# Altium schematic sheet FT2232H.SchDoc
size A
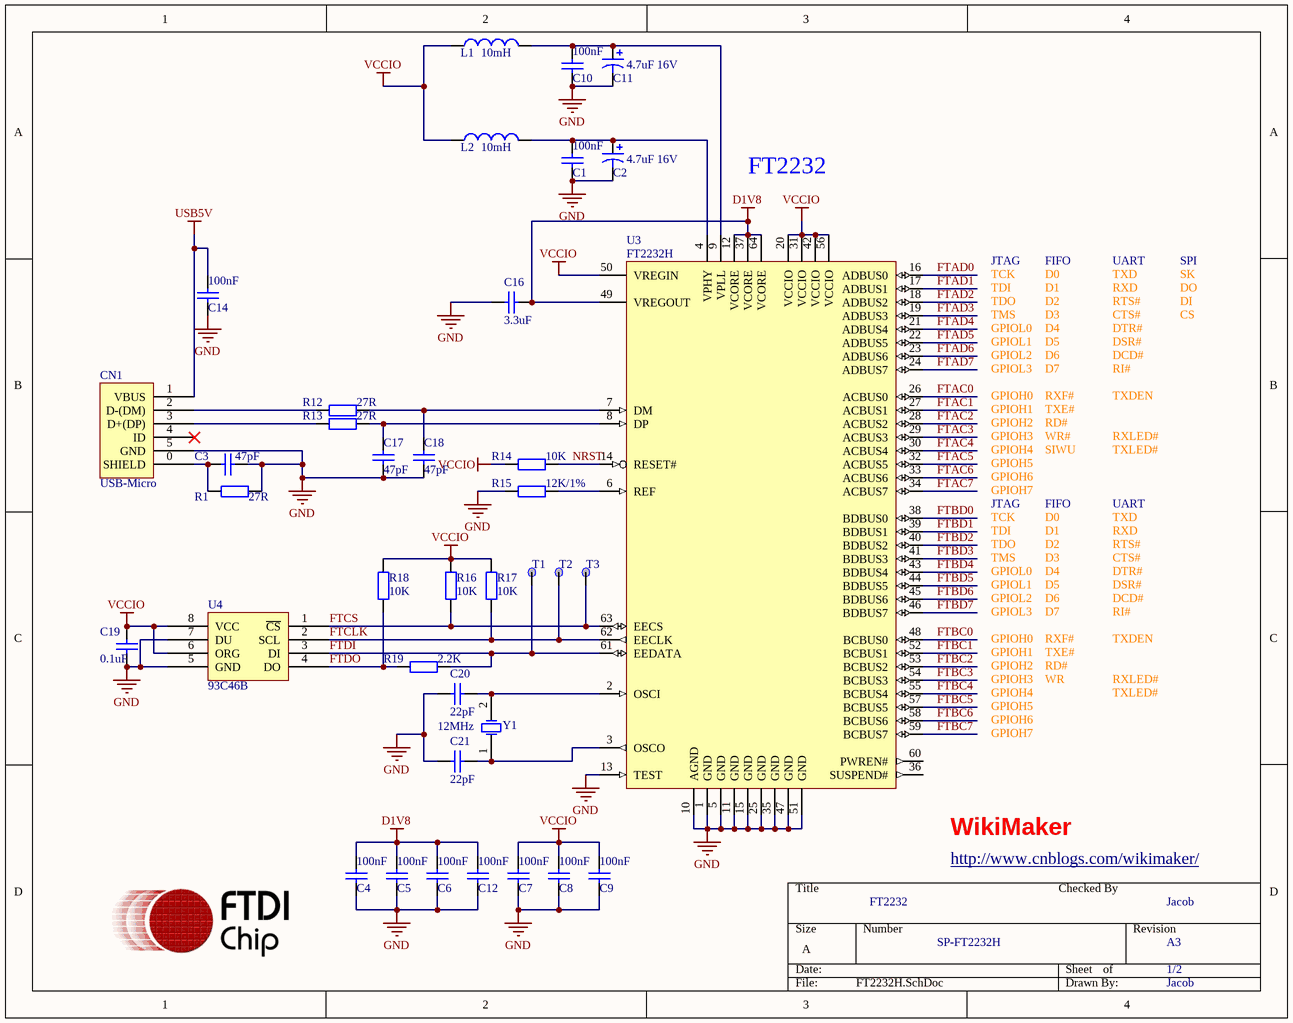
[diagram p0: FT2232H.SchDoc]

## Parts
C1  100nF  [0603M]
C2  4.7uF 16V  [0805M]
C3  47pF  [0603M]
C4  100nF  [0603M]
C5  100nF  [0603M]
C6  100nF  [0603M]
C7  100nF  [0603M]
C8  100nF  [0603M]
C9  100nF  [0603M]
C10  100nF  [0603M]
C11  4.7uF 16V  [0805M]
C12  100nF  [0603M]
C14  100nF  [0603M]
C16  3.3uF  [0805M]
C17  47pF  [0603M]
C18  47pF  [0603M]
C19  0.1uF  [0603M]
C20  22pF  [0603M]
C21  22pF  [0603M]
CN1  USB-Micro  [USB-MICRO-Lite]
L1  value 10mH  [0805M]  (hidden comment: Inductor)
L2  value 10mH  [0805M]  (hidden comment: Inductor)
R1  27R  [0603M]
R12  27R  [0603M]
R13  27R  [0603M]
R14  10K  [0603M]
R15  12K/1%  [0603M]
R16  10K  [0603M]
R17  10K  [0603M]
R18  10K  [0603M]
R19  2.2K  [0603M]
T1  TP  [TP-HOLE]  (value not drawn)
T2  TP  [TP-HOLE]  (value not drawn)
T3  TP  [TP-HOLE]  (value not drawn)
U3  FT2232H  [LQFP-64_N]
U4  93C46B  [SO8_L]
Y1  12MHz  [XTAL_socket]

## Nets
D1V8: C4.2 C5.2 C6.2 C12.2 C16.1 U3.12(VCORE) U3.37(VCORE) U3.49(VREGOUT) U3.64(VCORE)
GND: C1.1 C2.2 C3.2 C4.1 C5.1 C6.1 C7.1 C8.1 C9.1 C10.1 C11.2 C12.1 C14.1 C16.2 C17.1 C18.1 C19.2 C20.1 C21.1 CN1.5(GND) R1.1 R15.2 U3.1(GND) U3.5(GND) U3.10(AGND) U3.11(GND) U3.13(TEST) U3.15(GND) U3.25(GND) U3.35(GND) U3.47(GND) U3.51(GND) U4.5(GND) U4.7(DU)
USB5V: C14.2 CN1.1(VBUS)
VCCIO: C7.2 C8.2 C9.2 C19.1 L1.1 L2.1 R14.2 R16.1 R17.1 R18.1 U3.20(VCCIO) U3.31(VCCIO) U3.42(VCCIO) U3.50(VREGIN) U3.56(VCCIO) U4.6(ORG) U4.8(VCC)
FTAC0: U3.26(ACBUS0)
FTAC1: U3.27(ACBUS1)
FTAC2: U3.28(ACBUS2)
FTAC3: U3.29(ACBUS3)
FTAC4: U3.30(ACBUS4)
FTAC5: U3.32(ACBUS5)
FTAC6: U3.33(ACBUS6)
FTAC7: U3.34(ACBUS7)
FTAD0: U3.16(ADBUS0)
FTAD1: U3.17(ADBUS1)
FTAD2: U3.18(ADBUS2)
FTAD3: U3.19(ADBUS3)
FTAD4: U3.21(ADBUS4)
FTAD5: U3.22(ADBUS5)
FTAD6: U3.23(ADBUS6)
FTAD7: U3.24(ADBUS7)
FTBC0: U3.48(BCBUS0)
FTBC1: U3.52(BCBUS1)
FTBC2: U3.53(BCBUS2)
FTBC3: U3.54(BCBUS3)
FTBC4: U3.55(BCBUS4)
FTBC5: U3.57(BCBUS5)
FTBC6: U3.58(BCBUS6)
FTBC7: U3.59(BCBUS7)
FTBD0: U3.38(BDBUS0)
FTBD1: U3.39(BDBUS1)
FTBD2: U3.40(BDBUS2)
FTBD3: U3.41(BDBUS3)
FTBD4: U3.43(BDBUS4)
FTBD5: U3.44(BDBUS5)
FTBD6: U3.45(BDBUS6)
FTBD7: U3.46(BDBUS7)
FTCLK: R17.2 T2.1 U3.62(EECLK) U4.2(SCL)
FTCS: R16.2 T3.1 U3.63(EECS) U4.1(~{CS})
FTDI: R19.1 T1.1 U3.61(EEDATA) U4.3(DI)
FTDO: R18.2 R19.2 U4.4(DO)
NRST: R14.1 U3.14(RESET#)
NetC1_2: C1.2 C2.1 L2.2 U3.4(VPHY)
NetC3_1: C3.1 CN1.0(SHIELD) R1.2
NetC10_2: C10.2 C11.1 L1.2 U3.9(VPLL)
NetC17_2: C17.2 R13.1 U3.8(DP)
NetC18_2: C18.2 R12.1 U3.7(DM)
NetC20_2: C20.2 U3.2(OSCI) Y1.2(OSC2)
NetC21_2: C21.2 U3.3(OSCO) Y1.1(OSC1)
NetCN1_2: CN1.2(D-(DM)) R12.2
NetCN1_3: CN1.3(D+(DP)) R13.2
NetR15_1: R15.1 U3.6(REF)

Not connected (* = marked no-connect by the designer): CN1 4(ID)*; U3 36(SUSPEND#) 60(PWREN#)

## Notes on the sheet
- FT2232
- JTAG
- TDI
- TCK
- D0
- D1
- FIFO
- UART
- TXD
- RXD
- SPI
- SK
- DO
- TMS
- TDO
- GPIOL0
- GPIOL1
- GPIOL2
- GPIOL3
- D2
- D3
- D4
- D5
- D6
- D7
- RTS#
- CTS#
- DTR#
- DSR#
- DCD#
- RI#
- DI
- CS
- GPIOH0
- GPIOH1
- GPIOH2
- RXF#
- TXE#
- RD#
- TXDEN
- GPIOH3
- GPIOH4
- GPIOH5
- GPIOH6
- GPIOH7
- WR#
- SIWU
- RXLED#
- TXLED#
- WR
- WikiMaker
- http://www.cnblogs.com/wikimaker/
- Checked By
- Jacob
- SP-FT2232H
- A3
- 1/2

## Library data of the parts
C1 C3-C10 C12 C14 C16-C21 = Cap: Capacitor; Published: 8-Jun-2000; LatestRevisionDate: 17-Jul-2002; LatestRevisionNote: Re-released for DXP Platform.; PackageReference: RAD-0.3; Publisher: Altium Limited
  C1 C4-C10 C12 C14: PackageDescription: Radial Cap, Thru-Hole; 2 Leads; 0.3 in Pin Spacing; Value: 100nF
  C3 C17 C18: Value: 47pF
  C16: Value: 3.3uF
  C19: Value: 0.1uF
  C20 C21: Value: 22pF
C2 C11 = Cap Pol1: Polarized Capacitor (Radial); Published: 8-Jun-2000; LatestRevisionDate: 17-Jul-2002; LatestRevisionNote: Re-released for DXP Platform.; PackageReference: RB7.6-15; Publisher: Altium Limited; PackageDescription: Polarized Capacitor (Radial); 2 Leads
L1 L2 = Inductor: Code_IEC: 1005; Published: 8-Jun-2000; LatestRevisionDate: 29-May-2009; LatestRevisionNote: IPC-7351 Footprint Added.; PackageReference: 0402-A; Publisher: Altium Limited; PackageDescription: Chip Inductor; Code_JEITA: 0402
R1 R12-R19 = Res2: Resistor; Published: 8-Jun-2000; LatestRevisionDate: 17-Jul-2002; LatestRevisionNote: Re-released for DXP Platform.; PackageReference: AXIAL-0.4; Publisher: Altium Limited
  R1 R12 R13: Value: 27R
  R14 R16-R18: Value: 10K
  R15: Value: 12K/1%
  R19: Value: 2.2K
T1-T3 = TP: Test Point
U3 = FT2232HL-Reel: Dual High Speed USB To Multipurpose UART/FIFO IC, LQFP-64, Tape and Reel; Published: 19-Aug-2010; DatasheetVersion: ver 2.08, May-2010; PackageVersion: 2010; PackageReference: LQFP-64; Publisher: Altium Limited; PackageDescription: 64-Pin Thin Quad Flat Pack, 10 x 10 x 1.4 mm Body, 0.5 mm Pitch; ComponentLink1Description: Manufacturer Link; ComponentLink1URL: http://www.ftdichip.com/Products/ICs/FT2232H.htm; ComponentLink2Description: Datasheet; ComponentLink2URL: http://www.ftdichip.com/Support/Documents/DataSheets/ICs/DS_FT2232H.pdf
U4 = 93C46B: 1K Microwire Compatible Serial EEPROM
Y1 = XTAL: Crystal Oscillator; Published: 8-Jun-2000; LatestRevisionDate: 17-Jul-2002; LatestRevisionNote: Re-released for DXP Platform.; PackageReference: R38; Publisher: Altium Limited